# EAGLE design fedpower_mic841_reve (EAGLE 7.2.0)
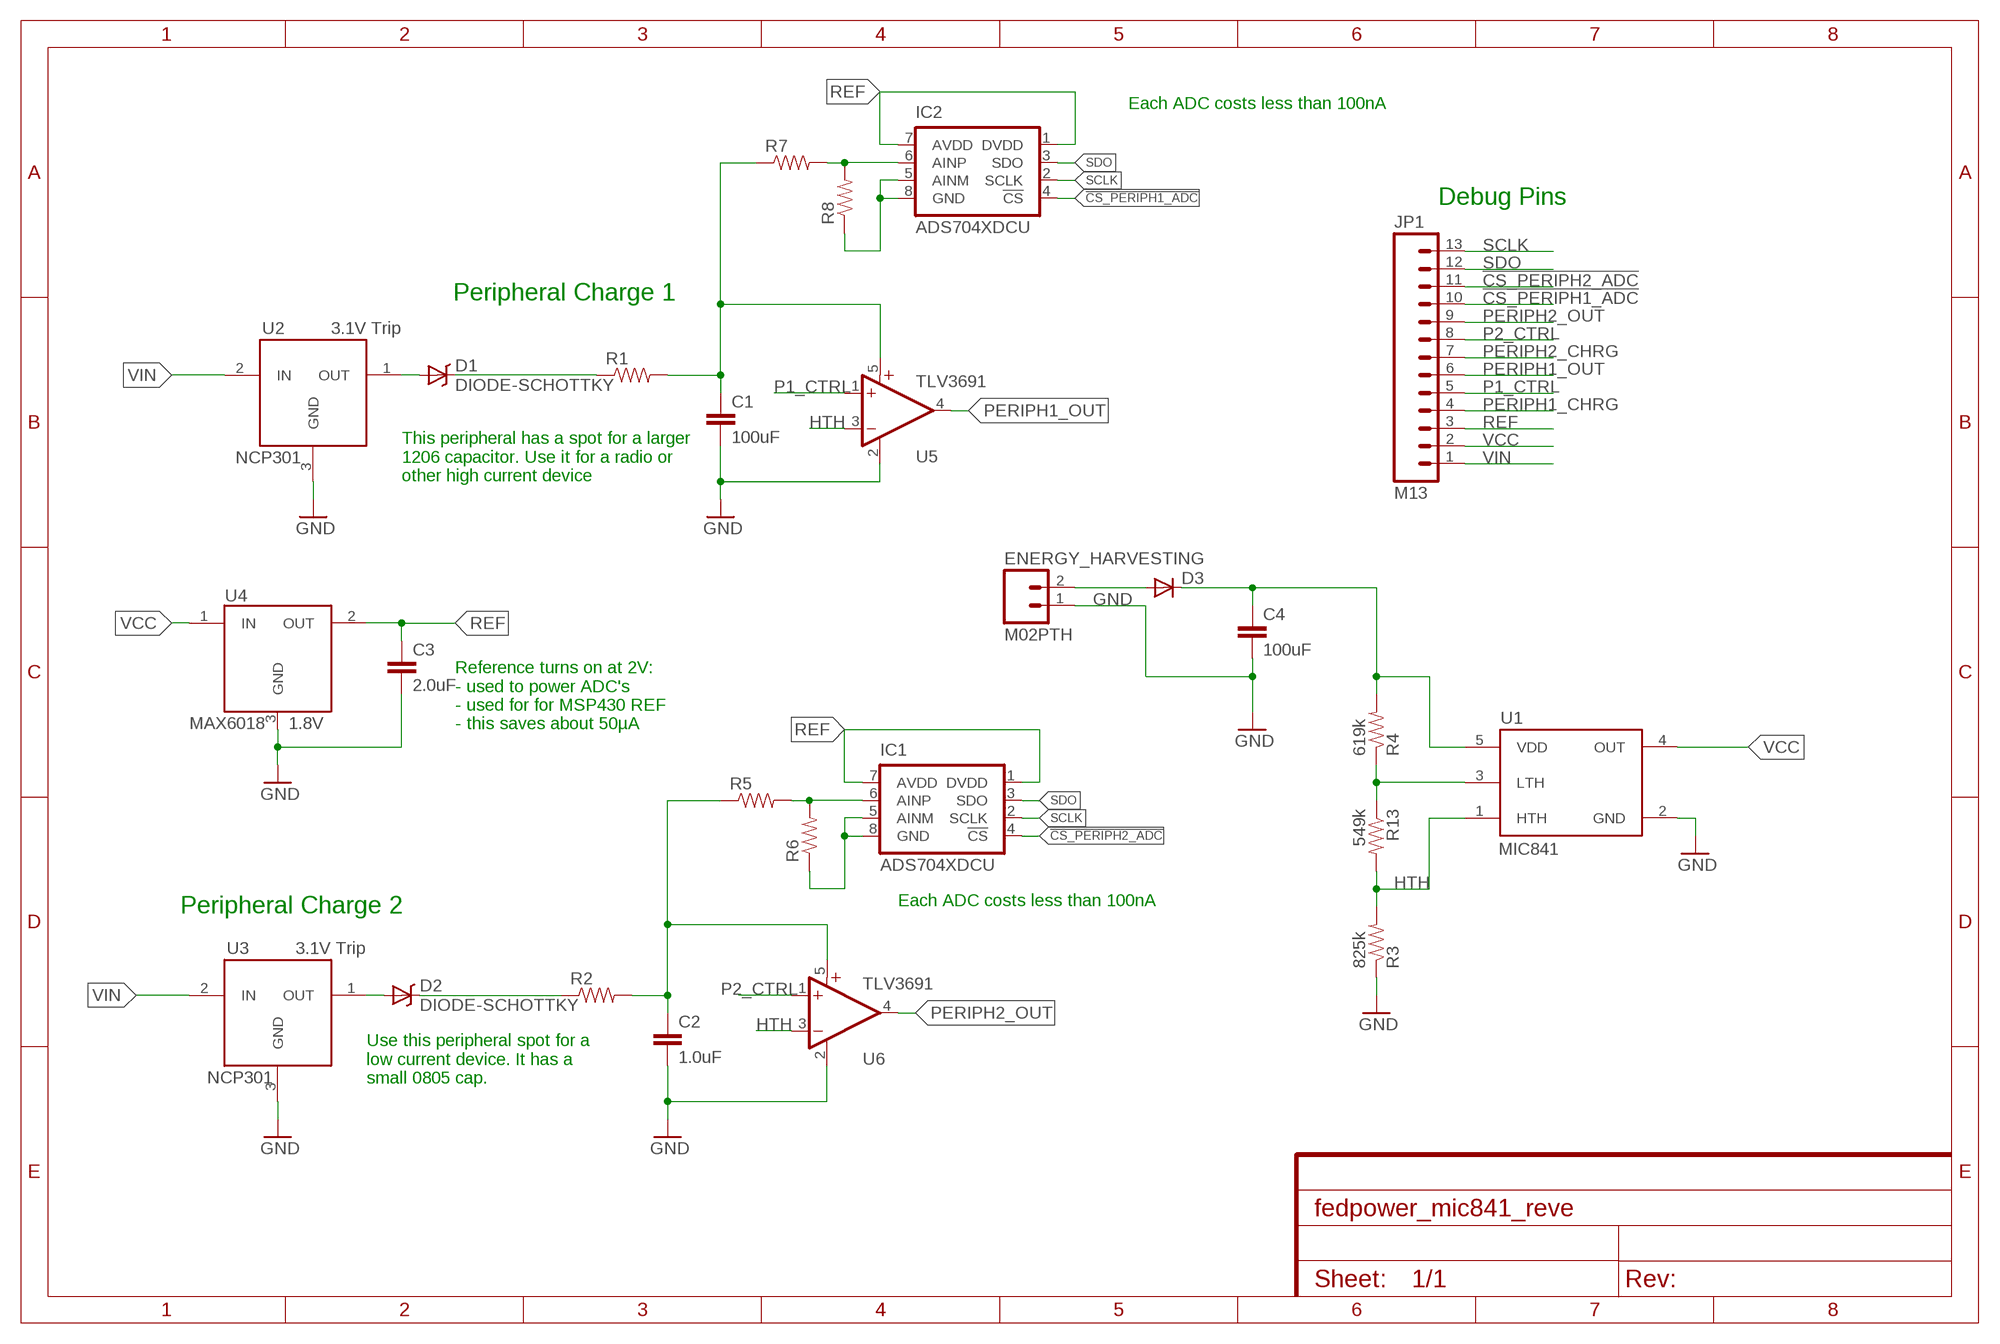
[diagram p0: schematic, sheet 1]
FRAME1 (FRAME-A4L): CNAME: Federated Power Board; CREVISION: C; DESIGNER: Josiah Hester

## Parts
C1  100uF  2.2UF50V10%(1206)  [1206]
C2  1.0uF  1.0UF-25V-+80/-20(0805)  [0805]
C3  2.0uF  1.0UF-25V-+80/-20(0805)  [0805]
C4  100uF  2.2UF-CERCAP-10009  [1206]
D1  DIODE-SCHOTTKY  [SOD-323]
D2  DIODE-SCHOTTKY  [SOD-323]
D3  DIODESOD  [SOD-323]
ENERGY_HARVESTING  M02PTH  [1X02]
IC1  ADS704XDCU  [DCU_(R-PDSO-G8)]
IC2  ADS704XDCU  [DCU_(R-PDSO-G8)]
JP1  M13  [1X13]
R1  0.3OHM-1/8W-1%(0805)  [0805]
R2  0.3OHM-1/8W-1%(0805)  [0805]
R3  825k  0.3OHM-1/8W-1%(0805)  [0805]
R4  619k  0.3OHM-1/8W-1%(0805)  [0805]
R5  0.3OHM-1/8W-1%(0805)  [0805]
R6  0.3OHM-1/8W-1%(0805)  [0805]
R7  0.3OHM-1/8W-1%(0805)  [0805]
R8  0.3OHM-1/8W-1%(0805)  [0805]
R13  549k  0.3OHM-1/8W-1%(0805)  [0805]
U1  MIC841  [SC70-5]
U2  3.1V Trip  NCP300"  [SOT-23-5_1PRIMARY]
U3  3.1V Trip  NCP300"  [SOT-23-5_1PRIMARY]
U4  1.8V  MAX6018  [SOT23-3]
U5  TLV3691  [SC70-5]
U6  TLV3691  [SC70-5]

## Nets
!CS_PERIPH1_ADC: IC2.4(!CS) JP1.10
!CS_PERIPH2_ADC: IC1.4(!CS) JP1.11
GND: C1.2 C2.2 C3.2 C4.2 ENERGY_HARVESTING.1 R3.1 U1.2(GND) U2.3(GND) U3.3(GND) U4.3(GND) U5.2(GND) U6.2(GND)
HTH: R3.2 R13.2 U1.1(HTH) U5.3(-IN) U6.3(-IN)
N$1: D1.2(A) U2.1(OUT)
N$2: R4.1 R13.1 U1.3(LTH)
N$3: D1.1(C) R1.1
N$4: D2.2(A) U3.1(OUT)
N$5: D3.2(A) ENERGY_HARVESTING.2
N$6: D2.1(C) R2.1
N$8: IC1.6(AINP) R5.2 R6.2
N$9: IC2.6(AINP) R7.2 R8.2
N$10: IC1.5(AINM) IC1.8(GND) R6.1
N$11: IC2.5(AINM) IC2.8(GND) R8.1
P1_CTRL: JP1.5 U5.1(+IN)
P2_CTRL: JP1.8 U6.1(+IN)
PERIPH1_CHRG: C1.1 JP1.4 R1.2 R7.1 U5.5(V+)
PERIPH1_OUT: JP1.6 U5.4(OUT)
PERIPH2_CHRG: C2.1 JP1.7 R2.2 R5.1 U6.5(V+)
PERIPH2_OUT: JP1.9 U6.4(OUT)
REF: C3.1 IC1.1(DVDD) IC1.7(AVDD) IC2.1(DVDD) IC2.7(AVDD) JP1.3 U4.2(OUT)
SCLK: IC1.2(SCLK) IC2.2(SCLK) JP1.13
SDO: IC1.3(SDO) IC2.3(SDO) JP1.12
VCC: JP1.2 U1.4(OUT) U4.1(IN)
VIN: C4.1 D3.1(C) JP1.1 R4.2 U1.5(VDD) U2.2(IN) U3.2(IN)
Unconnected: U2.4(NC) U2.5(NC) U3.4(NC) U3.5(NC)

## Notes on the sheet
- Each ADC costs less than 100nA
- Debug Pins
- Peripheral Charge 1
- NCP301
- This peripheral has a spot for a larger
  1206 capacitor. Use it for a radio or 
  other high current device
- MAX6018
- Reference turns on at 2V:
  - used to power ADC's
  - used for for MSP430 REF
  - this saves about 50µA
- Each ADC costs less than 100nA
- Peripheral Charge 2
- NCP301
- Use this peripheral spot for a 
  low current device. It has a 
  small 0805 cap.

## Library data of the parts
C1 = SparkFun-Capacitors:2.2UF50V10%(1206): CAP-10009; PROD_ID: CAP-10009; VALUE: 2.2UF
C2 = SparkFun-Capacitors:1.0UF-25V-+80/-20(0805): CAP-11625; PROD_ID: CAP-11625
C3 = SparkFun-Capacitors:1.0UF-25V-+80/-20(0805): CAP-11625; PROD_ID: CAP-11625; VALUE: 1.0uF
C4 = SparkFun-Capacitors:2.2UF-CER: 2.2uF Ceramic SMT CAP-07888- 10V, 20% (0603) CAP-10009- 50V, 10% (1206); PROD_ID: CAP-10009; VALUE: 2.2uF
D1 D2 = SparkFun-DiscreteSemi:DIODE-SCHOTTKY: Commonly MBRA140.
D3 = SparkFun-DiscreteSemi:DIODE: Diode These are standard reverse protection diodes and small signal diodes. SMA package can handle up to about 1A. SOD-323 can handle about 200mA. What the SOD-323 package when ordering, there are some mfgs out there that are 5-pin packages.; PROD_ID: DIO-09646
ENERGY_HARVESTING = SparkFun-Connectors:M02: Standard 2-pin 0.1" header. Use with - straight break away headers ( PRT-00116) - right angle break away headers (PRT-00553) - swiss pins (PRT-00743) - machine pins (PRT-00117) - female headers (PRT-00115) Molex polarized connector foot print use with: PRT-08233 with associated crimp pins and housings. 2.54_SCREWTERM for use with PRT-10571. 3.5mm Screw Terminal footprints for PRT-08084 5mm Screw Terminal footprints for use with PRT-08433
IC1 IC2 = fedpower:ADS704X: ADS704X Nanopower, Ultra-Small Size, 8,10,12-Bit, 1-MSPS, SAR ADC ADS7040: Data sheet <http://www.ti.com/lit/ds/symlink/ads7040.pdf> ADS7041: Data sheet <http://www.ti.com/lit/ds/symlink/ads7042.pdf> ADS7042: Data sheet <http://www.ti.com/lit/ds/symlink/ads7042.pdf>
JP1 = SparkFun-Connectors:M13: 13-pin single row .1" header
R1-R8 R13 = SparkFun-Resistors:0.3OHM-1/8W-1%(0805); PROD_ID: RES-11622; VALUE: 0.3
U1 = fedpower:MIC841: MIC841:Comparator with reference and adj. hysteresis
U2 U3 = Moo1.2:NCP300
U4 = fedpower:MAX6018: Precision, Micropower, 1.8V Supply, Low-Dropout, SOT23 Voltage Reference The MAX6018 is a precision, low-voltage, low-dropout, micropower voltage reference in a SOT23 package. This three-terminal reference operates with an input voltage from (VOUT + 200mV) to 5.5V, and is available with output voltage options of 1.2V, 1.6V, 1.8V, and 2.048V The MAX6018 voltage reference consumes less than 5µA (max) of supply current and can source and sink up to 1mA of load current.
U5 U6 = fedpower:TLV3691: 0.9-V to 6.5-V, Nanopower Comparator Datasheets Analog Signal Chain Guide <http://www.ti.com/lit/pdf/slyb174> TLV3691 <http://www.ti.com/lit/ds/symlink/tlv3691.pdf> Manufacturer Product Page TLV3691IDPFR Specifications <http://www.ti.com/general/docs/suppproductinfo.tsp?distId=10&orderablePartNumber=TLV3691IDPFR> Standard Package <javascript:dlgHelp('Standard%20Packaging%20Help');> 1 Category Integrated Circuits (ICs) </product-search/en/integrated-circuits-ics> Family Linear - Comparators </product-search/en/integrated-circuits-ics/linear-comparators/2556221> Series - Packaging <javascript:dlgHelp('Standard%20Packaging%20Help');> Cut Tape (CT) <javascript:dlgHelp('Cut%20Tape%20Help');> Type General Purpose Number of Elements 1 Output Type Push-Pull Voltage - Supply, Single/Dual (±) 0.9 V ~ 6.5 V, ±0.45 V ~ 3.25 V Voltage - Input Offset (Max) 3mV Current - Input Bias (Max) 100pA Current - Output (Typ) 42mA Current - Quiescent (Max) 150nA CMRR, PSRR (Typ) - Propagation Delay (Max) 35µs Hysteresis - Operating Temperature -40°C ~ 125°C Package / Case 6-XFDFN Mounting Type Surface Mount Supplier Device Package 6-X2SON (1x1) Online Catalog Comparators - 1 element </catalog/en/partgroup/comparators-1-element/3112?mpart=TLV3691IDPFR&vendor=296&WT.z_ref_page_type=PS&WT.z_ref_page_sub_type=PD&WT.z_ref_page_id=PD&WT.z_ref_page_event=DC_Link_Table> Other Names 296-37242-1

## Board
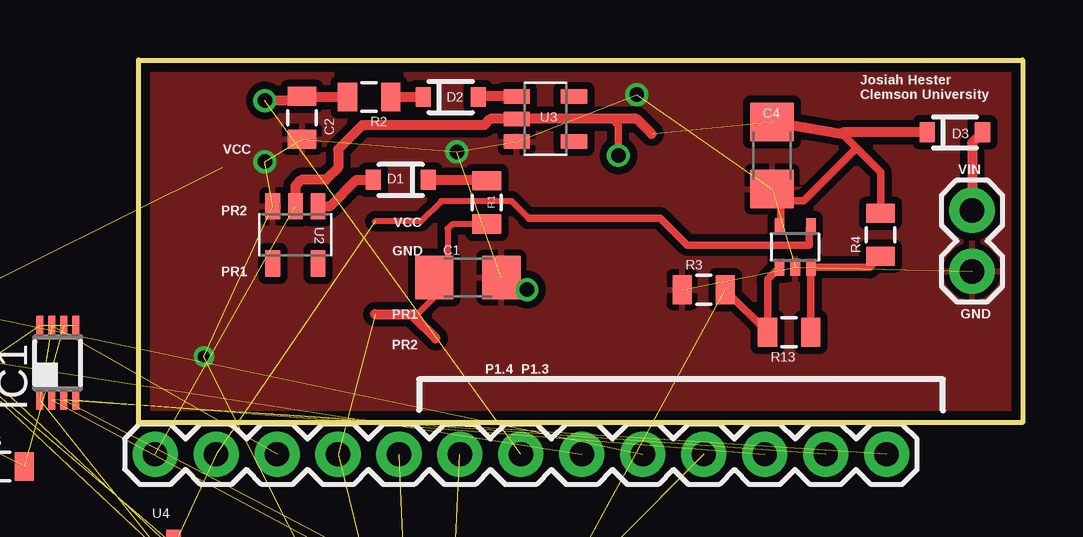
[diagram p1: board, top side]
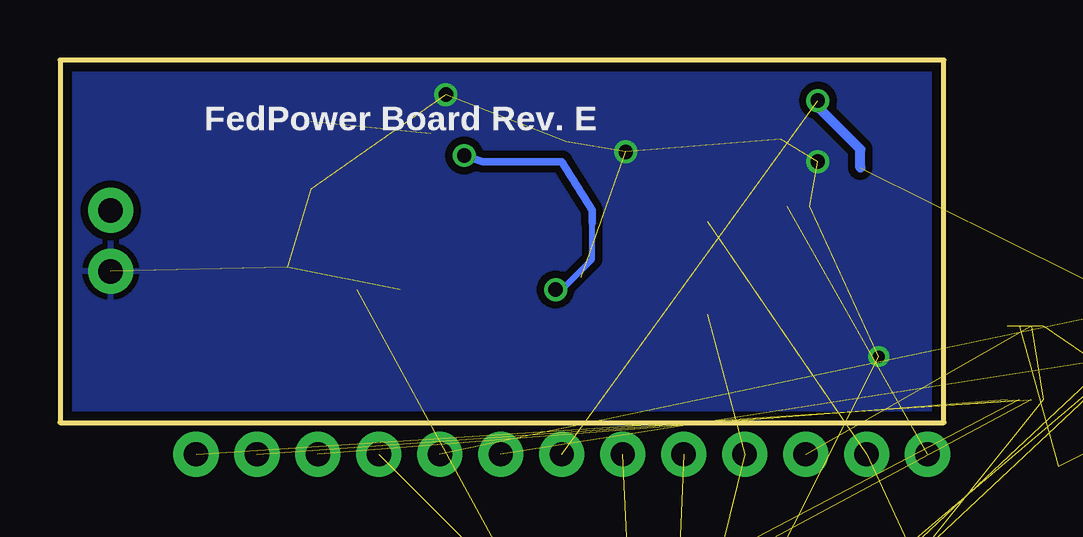
[diagram p2: board, bottom side, seen from below]

Size 36.83 x 15.11 mm. Coordinates in mm from the lower left corner, seen from the top.
Outline: 0,0 0,15.11 36.83,15.11 36.83,0 0,0
Copper layers (1*16): Top 0.0356mm / dielectric 1.5011mm / Bottom 0.0356mm
Design rules "LaenPCBOrder": minimum track width 6mil, minimum drill 13mil, track to track 6mil, track to pad 6mil, pad to pad 6mil, via to via 6mil, smd to smd 6mil, copper to edge 15mil, drill to drill 6mil, minimum pad ring 7mil, minimum via ring 7mil, stop-mask expansion 3mil, vias tented up to drill 0mil, thermal gap 10mil

### Footprints (pad centres in the part's own frame; a part is rotated, then mirrored left to right if it is on the bottom)
1206 = smd 1.6 x 1.8: 1 -1.4,0; 2 1.4,0
0805 = smd 0.8 x 1.2: 1 -0.9,0; 2 0.9,0
SOD-323 = smd 0.63 x 0.83: 1 -1.15,0; 2 1.15,0
1X02 = drill 1.016 pad 1.88: 1 0,0; 2 2.54,0
DCU_(R-PDSO-G8) = smd 0.3 x 0.8: 1 -0.75,-1.55; 2 -0.25,-1.55; 3 0.25,-1.55; 4 0.75,-1.55; 5 0.75,1.55; 6 0.25,1.55; 7 -0.25,1.55; 8 -0.75,1.55
1X13 = drill 1.016 pad 1.88: 1 0,0; 2 2.54,0; 3 5.08,0; 4 7.62,0; 5 10.16,0; 6 12.7,0; 7 15.24,0; 8 17.78,0; 9 20.32,0; 10 22.86,0; 11 25.4,0; 12 27.94,0; 13 30.48,0
SC70-5 = smd 0.4 x 0.7: 1 -0.65,-0.85; 2 0,-0.85; 3 0.65,-0.85; 4 0.65,0.85; 5 -0.65,0.85
SOT-23-5_1PRIMARY = smd 1.092 x 0.61: 1 -1.194,0.94; 2 -1.194,0; 3 -1.194,-0.94; 4 1.194,-0.94; 5 1.194,0.94
SOT23-3 = smd 0.6 x 1.2: 1 -0.95,-1.075; 2 0.95,-1.075; 3 0,1.075

### Placement (x,y rotation side)
C1  13.71,6.05 0 top
C2  6.8,12.71 270 top
C3  8.3,-6.65 90 top  (outside the outline)
C4  26.39,11.13 270 top
D1  10.92,10.12 180 top
D2  13,13.57 0 top
D3  34.01,12.1 0 top
ENERGY_HARVESTING  34.72,6.31 90 top
IC1  -3.38,2.5 0 top
IC2  14.65,-9.44 90 top  (outside the outline)
JP1  0.68,-1.31 0 top
R1  14.5,9.18 270 top
R2  9.6,13.57 180 top
R3  23.54,5.54 0 top
R4  30.91,7.83 90 top
R5  -5.67,-1.82 0 top  (outside the outline)
R6  -9.22,-0.04 0 top  (outside the outline)
R7  9.07,-10.97 90 top  (outside the outline)
R8  10.59,-9.95 90 top  (outside the outline)
R13  27.1,3.77 180 top
U1  27.35,7.32 0 top
U2  6.53,7.83 270 top
U3  16.94,12.66 0 top
U4  1.45,-6.14 0 top  (outside the outline)
U5  12.11,-15.03 0 top  (outside the outline)
U6  -7.95,3.77 0 top  (outside the outline)

### Tracks (layer width: path | path; a pad name or v marks a point on that pad's centre or on a via)
!CS_PERIPH1_ADC  (1 unrouted)
!CS_PERIPH2_ADC  (1 unrouted)
GND  (via drill 0.5, 0.6)  (15 unrouted)
  other vias: 20.75,13.67 5.26,10.88 2.72,2.75 13.26,11.29
  pour Top (isolate 0.305): 0,0.25 0,15.11 36.83,15.24 36.83,0.38
  pour Bottom (isolate 0.305): 0,0.38 0,14.99 36.83,14.99 36.83,0.38
HTH  (2 unrouted)
  Top 0.305: R3.2 24.44,5.52 R13.2 26.2,5.97 U1.1
N$1
  Top 0.406: U2.1 7.97,9.02 9.07,10.12 D1.2
N$2
  Top 0.305: R4.1 30.45,6.47 U1.3 R13.1
N$3
  Top 0.406: D1.1 14.46,10.12 R1.1
N$4
  Top 0.406: U3.1 14.18,13.6 D2.2
N$5
  Top 0.406: D3.2 34.72,11.66 ENERGY_HARVESTING.2
N$6
  Top 0.406: D2.1 R2.1
N$8  (2 unrouted)
N$9  (2 unrouted)
N$10  (2 unrouted)
N$11  (2 unrouted)
P1_CTRL  (1 unrouted)
P2_CTRL  (1 unrouted)
PERIPH1_CHRG  (3 unrouted)
  Top 0.254: R1.2 13.07,8.28 12.88,8.08 12.88,6.11 C1.1 | 12.72,5.89 12.72,5.65 11.48,4.4
  Top 0.406: 12.72,5.89 C1.1 12.88,6.37 | 9.85,4.53 11.35,4.53 11.48,4.4 12.37,3.51
PERIPH1_OUT  (1 unrouted)
PERIPH2_CHRG  (via drill 0.6)  (3 unrouted)
  Top 0.406: R2.2 6.84,13.57 | 6.84,13.57 C2.1 | 6.84,13.57 6.69,13.42 v5.26,13.42
  Bottom 0.406: 3.48,10.62 3.48,11.39 5.26,13.16 v5.26,13.42
PERIPH2_OUT  (1 unrouted)
REF  (6 unrouted)
SCLK  (2 unrouted)
SDO  (2 unrouted)
VCC  (2 unrouted)
  Top 0.254: 16.24,8.53 15.54,9.23 12.6,9.23 11.76,8.39 9.85,8.39
  Top 0.305: U1.4 27.94,8.11 27.94,7.4 22.86,7.4 21.73,8.53 16.24,8.53
VIN  (via drill 0.6)  (2 unrouted)
  Top 0.254: 16.4,5.77 v16.18,5.54
  Top 0.305: v19.99,11.13 19.99,12.4 19.73,12.66 | 29.32,12.03 29.87,11.49 | 29.87,11.49 30.91,10.44 R4.2 | U1.5 26.74,8.21 26.74,9 27,9.25 27.71,9.25 29.87,11.41 29.87,11.49
  Top 0.406: D3.1 29.39,12.1 | 29.39,12.1 29.33,12.1 | C4.1 29.32,12.03 29.39,12.1 | 21.37,12.03 20.75,12.66 19.73,12.66 U3.2 14.65,12.66 14.4,12.4 9.32,12.4 8.3,11.39 8.3,10.62 7.8,10.12 6.78,10.12 6.53,9.86 U2.2
  Bottom 0.254: v16.18,5.54 15.92,5.54 14.65,6.81 14.65,8.34
  Bottom 0.305: 14.65,8.34 14.65,8.85 15.92,10.88 19.23,10.88 v19.99,11.13

### Text on the board
tPlace: Josiah Hester / Clemson University | VCC | VIN | PR2 | VCC | GND | PR1 | PR1 | GND | PR2 | P1.4 | P1.3
bPlace: FedPower Board Rev. E